# Altium schematic sheet CANTransceiver.SchDoc: CANTransceiver
size A4; Author: Carlos Barreiro; Organization: Escuela Técnica Superior de Ingeniería de Sistemas Informáticos de la Universidad Politécnica de Madrid; Address1: Campus Sur de la Universidad Politécnica de Madrid; Address2: Calle de Alan Turing, s/nº; Address3: Madrid 28031; Address4: España; DocumentNumber: 16; Revision: A; SheetNumber: 16; SheetTotal: 16
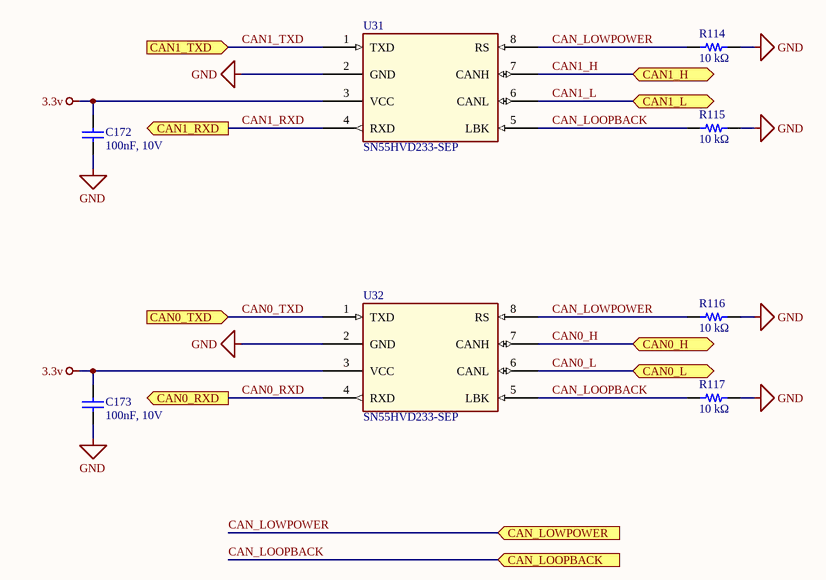
[diagram p0: CANTransceiver.SchDoc]

## Parts
C172  100nF, 10V  [WURTH_WCAP-CSGP_0402]
C173  100nF, 10V  [WURTH_WCAP-CSGP_0402]
R114  10 kΩ  [PANASONIC_ERJ2G_0402]
R115  10 kΩ  [PANASONIC_ERJ2G_0402]
R116  10 kΩ  [PANASONIC_ERJ2G_0402]
R117  10 kΩ  [PANASONIC_ERJ2G_0402]
U31  SN55HVD233-SEP  [TEXAS_SOIC8D]
U32  SN55HVD233-SEP  [TEXAS_SOIC8D]

## Ports
CAN0_H (bidir), CAN0_L (bidir), CAN0_RXD (out), CAN0_TXD (in), CAN1_H (bidir), CAN1_L (bidir), CAN1_RXD (out), CAN1_TXD (in), CAN_LOOPBACK (in), CAN_LOWPOWER (in)

## Nets
3.3v: C172.2 C173.2 U31.3(VCC) U32.3(VCC)
GND: C172.1 C173.1 R114.2 R115.2 R116.2 R117.2 U31.2(GND) U32.2(GND)
CAN0_H: U32.7(CANH) ; port CAN0_H
CAN0_L: U32.6(CANL) ; port CAN0_L
CAN0_RXD: U32.4(RXD) ; port CAN0_RXD
CAN0_TXD: U32.1(TXD) ; port CAN0_TXD
CAN1_H: U31.7(CANH) ; port CAN1_H
CAN1_L: U31.6(CANL) ; port CAN1_L
CAN1_RXD: U31.4(RXD) ; port CAN1_RXD
CAN1_TXD: U31.1(TXD) ; port CAN1_TXD
CAN_LOOPBACK: R115.1 R117.1 U31.5(LBK) U32.5(LBK) ; port CAN_LOOPBACK
CAN_LOWPOWER: R114.1 R116.1 U31.8(RS) U32.8(RS) ; port CAN_LOWPOWER

## Notes on the sheet
- Project:
- Title:
- Date:
- Designer:
- Sheet
- Revision:
- of
- Commit:

## Library data of the parts
C172 C173 = 885012205018: WCAP-CSGP Multilayer Ceramic Chip Capacitor, General Purpose, size 0402, X7R, 100nF, 10V; Manufacturer: Wurth Elektronik; Rated Voltage: 10VDC; Isolation Resistance  min.: 5GOhm; Capacitance Tolerance: +/-10%; Dissipation Factor max.: 5%; Technical Reference: X7R0402104K010DFCT10000; ComponentLink1Description: Manufacturer; ComponentLink1URL: http://www.we-online.de; ComponentLink2Description: Datasheet; ComponentLink2URL: https://www.we-online.com/catalog/datasheet/885012205018.pdf; Operating Temperature: -55 to +125degC; Packaging: Tape and Reel; Manufacturer Part Number: 885012205018; Published Date: April 2021; Ceramic Type: X7R; Height: 0.5mm; Mounting Technology: SMT; Size: 0402; Capacitance: 100nF; Q-Factor min.: -
R114-R117 = ERJ2RKF1002X: General Purpose Thick Film Chip Resistors; Manufacturer: Panasonic; Power (0402): 0.1 W; Limiting Voltage (0402): 50; Maximum Voltage (0402): 100; Resistance Range (Ω): 1Ω to 100MΩ; AEC 200: Grade 0; Size (0402): 2GE; ComponentLink1Description: Catalog; ComponentLink1URL: https://industrial.panasonic.com/ww/products/pt/general-purpose-chip-resistors/models?op=search&model_status_current=1&page=0#model-list-search-results; Series: ERJ; Temperature Range (ºC): -55 to +155; Supplier 1: Digi-Key; Supplier 2: Mouser; Supplier Part Number 1: P10.0KLCT-ND; Supplier Part Number 2: 667-ERJ-2RKF1002X
U31 U32 = SN55HVD233-SEP: Radiation hardened 3.3V CAN transceiver in space enhanced plastic package with standby mode; Supply voltage (V): 3 to 3.6; Bus fault voltage (V): -16 to 16; Signaling rate (Max) (Mbps): 1; Common mode voltage (V): -7 to 12; Isolated: No; Single Event Latch-up (SEL): 43 MeV-cm2/mg; Total Ionizing Dose (TID): 20 krad(Si); ComponentLink1Description: Manufacturer; ComponentLink1URL: https://www.ti.com/product/SN55HVD233-SEP#pps; Rating: Space; Operating temperature range (C): -55 to 125; Package: SOIC 8